# EAGLE design block_udn2951Z (EAGLE 7.7.0)
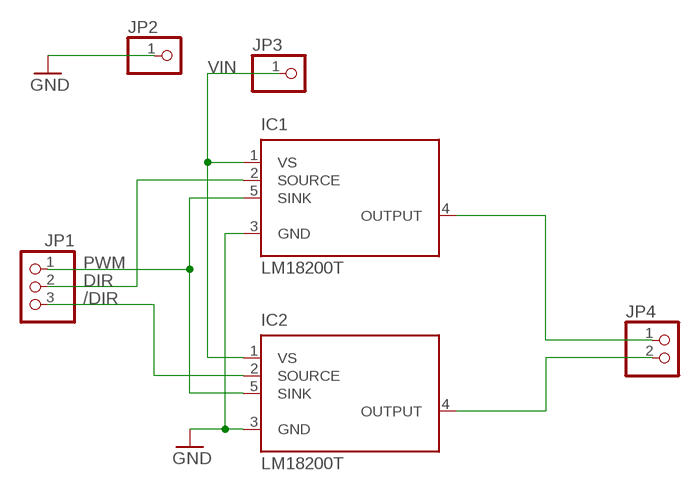
[diagram p0: schematic, sheet 1]

## Parts
IC1  LM18200T  [T05A]
IC2  LM18200T  [T05A]
JP1  PINHD-1X3  [1X03]
JP2  PINHD-1X1  [1X01]
JP3  PINHD-1X1  [1X01]
JP4  PINHD-1X2  [1X02]

## Nets
/DIR: IC2.2(SOURCE) JP1.3
DIR: IC1.2(SOURCE) JP1.2
GND: IC1.3(GND) IC2.3(GND) JP2.1
N$1: IC1.4(OUTPUT) JP4.1
N$2: IC2.4(OUTPUT) JP4.2
PWM: IC1.5(SINK) IC2.5(SINK) JP1.1
VIN: IC1.1(VS) IC2.1(VS) JP3.1

## Library data of the parts
IC1 IC2 = UDN2951z:LM18200T: 8A, 50V H-Bridge Motor Drivers SourcE: http://WWW.ALLDATASHEET.COM/
JP1 = pinhead:PINHD-1X3: PIN HEADER
JP2 JP3 = pinhead:PINHD-1X1: PIN HEADER
JP4 = pinhead:PINHD-1X2: PIN HEADER

## Board
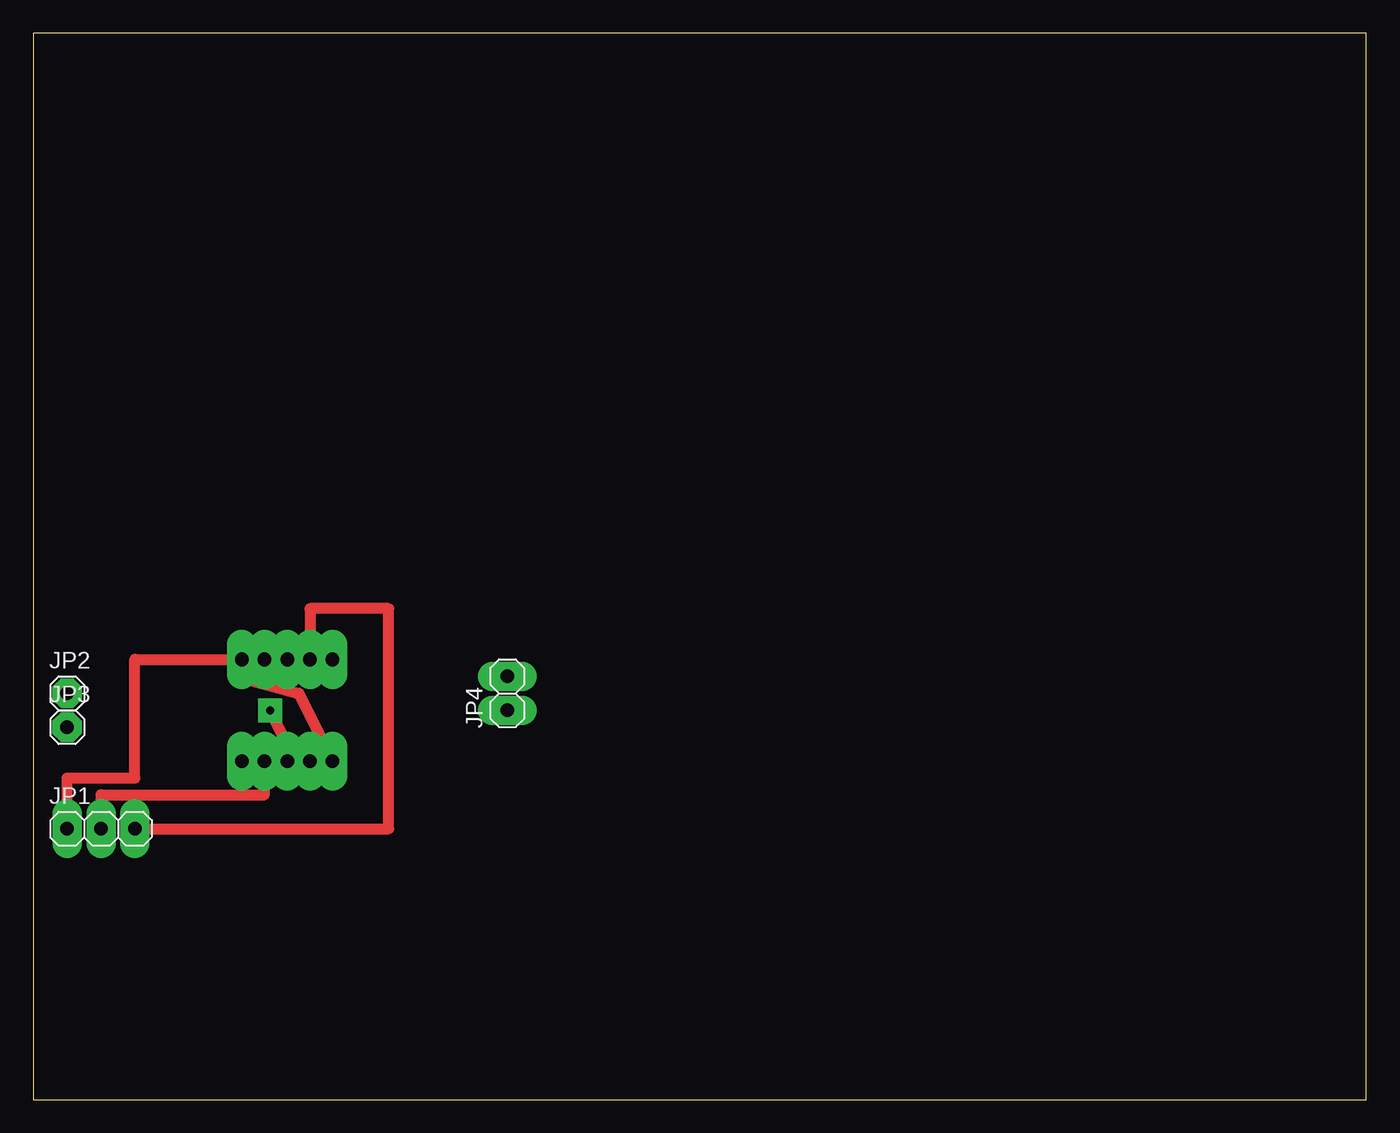
[diagram p1: board, top side]
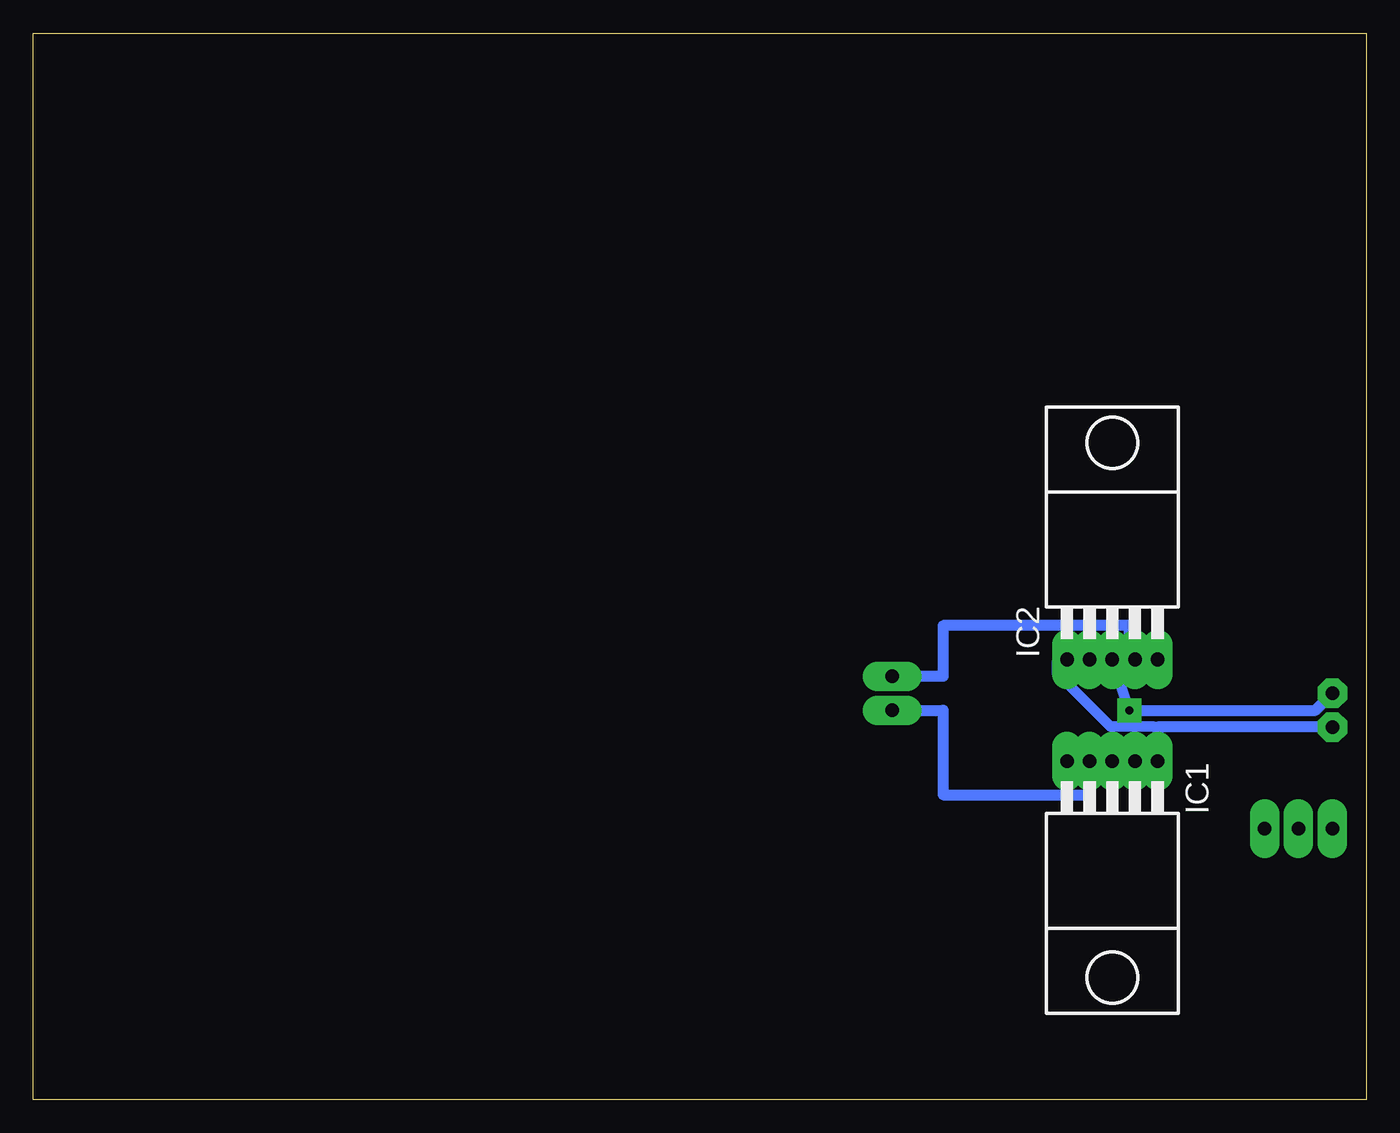
[diagram p2: board, bottom side, seen from below]

Size 100 x 80 mm. Coordinates in mm from the lower left corner, seen from the top.
Outline: 0,0 100,0 100,80 0,80 0,0
Copper layers (1*16): Top 0.035mm / dielectric 1.5mm / Bottom 0.035mm
Design rules "hobby": minimum track width 0.8mm, minimum drill 0.8mm, track to track 0.8mm, track to pad 0.8mm, pad to pad 0.45mm, via to via 0.8mm, smd to smd 8mil, copper to edge 10mil, drill to drill 8mil, minimum pad ring 0.6mm, minimum via ring 0.6mm, stop-mask expansion 0mil, vias tented up to drill 0mil, thermal gap 10mil

### Footprints (pad centres in the part's own frame; a part is rotated, then mirrored left to right if it is on the bottom)
T05A = drill 1.016 long: 1 -3.404,-8.89; 2 -1.702,-8.89; 3 0,-8.89; 4 1.702,-8.89; 5 3.404,-8.89
1X03 = drill 1.016 long: 1 -2.54,0; 2 0,0; 3 2.54,0
1X01 = drill 1.016 octagon: 1 0,0
1X02 = drill 1.016 long: 1 -1.27,0; 2 1.27,0

### Placement (x,y rotation side)
IC1  19.05,16.51 180 bottom
IC2  19.05,41.91 0 bottom
JP1  5.08,20.32 0 top
JP2  2.54,30.48 0 top
JP3  2.54,27.94 0 top
JP4  35.56,30.48 90 top

### Tracks (layer width: path | path; a pad name or v marks a point on that pad's centre or on a via)
/DIR
  Top 0.813: JP1.3 26.67,20.32 26.67,36.83 20.75,36.83 IC2.2
DIR
  Top 0.813: JP1.2 5.08,22.86 17.35,22.86 IC1.2
GND  (via drill 0.6)
  Top 0.813: IC1.3 19.05,26.67 v17.78,29.21
  Bottom 0.813: IC2.3 v17.78,29.21 3.81,29.21 JP2.1
N$1
  Bottom 0.813: JP4.1 31.75,29.21 31.75,22.86 20.75,22.86 IC1.4
N$2
  Bottom 0.813: IC2.4 17.78,33.02 17.78,35.56 31.75,35.56 31.75,31.75 JP4.2
PWM
  Top 0.813: JP1.1 2.54,24.13 7.62,24.13 7.62,33.02 15.24,33.02 | IC2.5 15.24,33.02 | 15.24,33.02 15.24,31.75 19.91,30.48 IC1.5
VIN
  Bottom 0.8: IC2.1 23.2,32.8 23.2,32 19.2,28 16,28 15.65,27.94
  Bottom 0.813: JP3.1 15.65,27.94 IC1.1